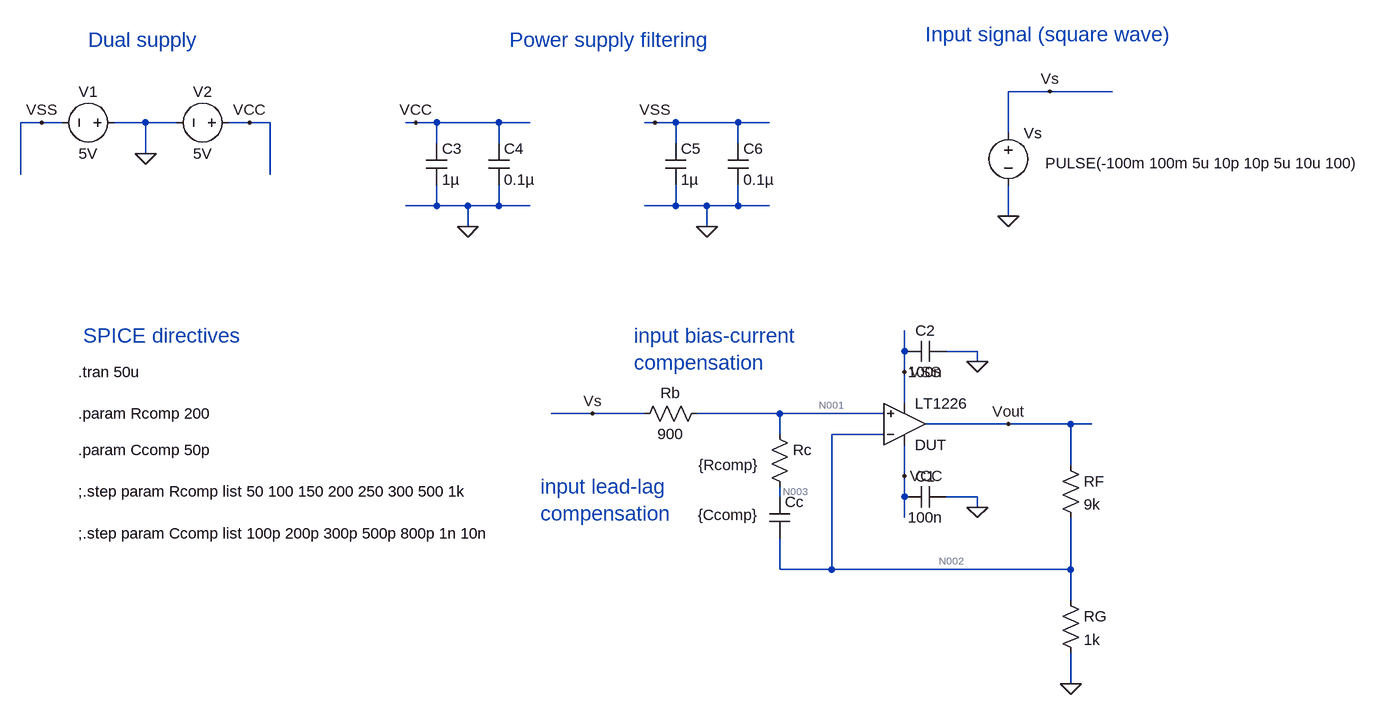
[diagram p0: schematic tb_lag_compensation.asc]
tb_lag_compensation.asc, the LTspice schematic file:
Version 4
SHEET 1 2184 868
WIRE 704 -336 640 -336
WIRE 800 -336 704 -336
WIRE -848 -288 -880 -288
WIRE -816 -288 -848 -288
WIRE -688 -288 -736 -288
WIRE -640 -288 -688 -288
WIRE -528 -288 -560 -288
WIRE -496 -288 -528 -288
WIRE -272 -288 -288 -288
WIRE -240 -288 -272 -288
WIRE -144 -288 -240 -288
WIRE -96 -288 -144 -288
WIRE 96 -288 80 -288
WIRE 128 -288 96 -288
WIRE 224 -288 128 -288
WIRE 272 -288 224 -288
WIRE 640 -272 640 -336
WIRE -240 -256 -240 -288
WIRE -144 -256 -144 -288
WIRE 128 -256 128 -288
WIRE 224 -256 224 -288
WIRE -688 -240 -688 -288
WIRE -880 -208 -880 -288
WIRE -496 -208 -496 -288
WIRE -240 -160 -240 -192
WIRE -240 -160 -288 -160
WIRE -192 -160 -240 -160
WIRE -144 -160 -144 -192
WIRE -144 -160 -192 -160
WIRE -96 -160 -144 -160
WIRE 128 -160 128 -192
WIRE 128 -160 80 -160
WIRE 176 -160 128 -160
WIRE 224 -160 224 -192
WIRE 224 -160 176 -160
WIRE 272 -160 224 -160
WIRE 640 -144 640 -192
WIRE -192 -128 -192 -160
WIRE 176 -128 176 -160
WIRE 480 64 480 32
WIRE 592 64 544 64
WIRE 592 80 592 64
WIRE 480 96 480 64
WIRE 480 144 480 96
WIRE 0 160 -64 160
WIRE 80 160 0 160
WIRE 288 160 160 160
WIRE 448 160 288 160
WIRE 640 176 512 176
WIRE 736 176 640 176
WIRE 768 176 736 176
WIRE 288 192 288 160
WIRE 448 192 368 192
WIRE 736 240 736 176
WIRE 480 256 480 208
WIRE 288 288 288 272
WIRE 480 288 480 256
WIRE 592 288 544 288
WIRE 592 304 592 288
WIRE 480 320 480 288
WIRE 288 400 288 352
WIRE 368 400 368 192
WIRE 368 400 288 400
WIRE 736 400 736 320
WIRE 736 400 368 400
WIRE 736 448 736 400
WIRE 736 576 736 528
FLAG -688 -240 0
FLAG -528 -288 VCC
FLAG -848 -288 VSS
FLAG -192 -128 0
FLAG 176 -128 0
FLAG -272 -288 VCC
FLAG 96 -288 VSS
FLAG 480 256 VCC
FLAG 480 96 VSS
FLAG 640 176 Vout
FLAG 640 -144 0
FLAG 704 -336 Vs
FLAG 592 80 0
FLAG 592 304 0
FLAG 736 576 0
FLAG 0 160 Vs
SYMBOL voltage -720 -288 R90
WINDOW 0 -32 56 VBottom 2
WINDOW 3 32 56 VTop 2
WINDOW 123 0 0 Left 2
WINDOW 39 0 0 Left 2
SYMATTR InstName V1
SYMATTR Value 5V
SYMBOL voltage -544 -288 R90
WINDOW 0 -32 56 VBottom 2
WINDOW 3 32 56 VTop 2
SYMATTR InstName V2
SYMATTR Value 5V
SYMBOL cap -256 -256 R0
SYMATTR InstName C3
SYMATTR Value 1µ
SYMBOL cap -160 -256 R0
SYMATTR InstName C4
SYMATTR Value 0.1µ
SYMBOL cap 112 -256 R0
SYMATTR InstName C5
SYMATTR Value 1µ
SYMBOL cap 208 -256 R0
SYMATTR InstName C6
SYMATTR Value 0.1µ
SYMBOL Opamps\\LT1226 480 240 M180
SYMATTR InstName DUT
SYMBOL cap 544 304 M270
WINDOW 0 32 32 VTop 2
WINDOW 3 0 32 VBottom 2
SYMATTR InstName C1
SYMATTR Value 100n
SYMBOL cap 544 80 M270
WINDOW 0 32 32 VTop 2
WINDOW 3 0 32 VBottom 2
SYMATTR InstName C2
SYMATTR Value 100n
SYMBOL voltage 640 -288 R0
WINDOW 3 57 62 Left 2
WINDOW 123 0 0 Left 2
WINDOW 39 0 0 Left 2
SYMATTR Value PULSE(-100m 100m 5u 10p 10p 5u 10u 100)
SYMATTR InstName Vs
SYMBOL res 720 224 R0
SYMATTR InstName RF
SYMATTR Value 9k
SYMBOL res 720 432 R0
SYMATTR InstName RG
SYMATTR Value 1k
SYMBOL res 272 176 R0
WINDOW 3 -109 63 Left 2
SYMATTR InstName Rc
SYMATTR Value {Rcomp}
SYMBOL cap 272 288 R0
WINDOW 3 -110 28 Left 2
SYMATTR InstName Cc
SYMATTR Value {Ccomp}
SYMBOL res 176 144 R90
WINDOW 0 0 56 VBottom 2
WINDOW 3 32 56 VTop 2
SYMATTR InstName Rb
SYMATTR Value 900
TEXT -776 -416 Left 3 ;Dual supply
TEXT -128 -416 Left 3 ;Power supply filtering
TEXT -792 96 Left 2 !.tran 50u
TEXT -784 40 Left 3 ;SPICE directives
TEXT 512 -424 Left 3 ;Input signal (square wave)
TEXT -792 160 Left 2 !.param Rcomp 200
TEXT -792 216 Left 2 !.param Ccomp 50p
TEXT -792 280 Left 2 !;.step param Rcomp list 50 100 150 200 250 300 500 1k
TEXT -792 344 Left 2 !;.step param Ccomp list 100p 200p 300p 500p 800p 1n 10n
TEXT -80 272 Left 3 ;input lead-lag\ncompensation
TEXT 64 40 Left 3 ;input bias-current\ncompensation

The netlist it stands for:
* tb_lag_compensation.asc
V1 0 VSS 5V
V2 VCC 0 5V
C3 VCC 0 1µ
C4 VCC 0 0.1µ
C5 VSS 0 1µ
C6 VSS 0 0.1µ
XDUT N001 N002 VCC VSS Vout LT1226  ; pins In+ In- V+ V- OUT
C1 0 VCC 100n
C2 0 VSS 100n
Vs Vs 0 PULSE(-100m 100m 5u 10p 10p 5u 10u 100)
RF Vout N002 9k
RG N002 0 1k
Rc N001 N003 {Rcomp}
Cc N003 N002 {Ccomp}
Rb N001 Vs 900
* Dual supply
* Power supply filtering
.tran 50u
* SPICE directives
* Input signal (square wave)
.param Rcomp 200
.param Ccomp 50p
;.step param Rcomp list 50 100 150 200 250 300 500 1k
;.step param Ccomp list 100p 200p 300p 500p 800p 1n 10n
* input lead-lag
* compensation
* input bias-current
* compensation
.backanno
.end

* Results of the author's LTspice run, read from the files saved beside the schematic
* Operating Point, zero values left out:
*   V(vss) = -5 V
*   V(vcc) = 5 V
*   V(n002) = -103.6 mV
*   V(n001) = -103.6 mV
*   V(vout) = -999.9 mV
*   V(vs) = -100 mV
*   V(n003) = -103.6 mV
*   I(Rb) = -3.998 µA
*   I(Rg) = -103.6 µA
*   I(Rf) = -99.59 µA
*   I(Vs) = -3.998 µA
*   I(V2) = -6.951 mA
*   I(V1) = -7.059 mA
*   Ix(dut:1) = 3.998 µA
*   Ix(dut:2) = 3.999 µA
*   Ix(dut:3) = 6.951 mA
*   Ix(dut:4) = -7.059 mA
*   Ix(dut:5) = 99.59 µA
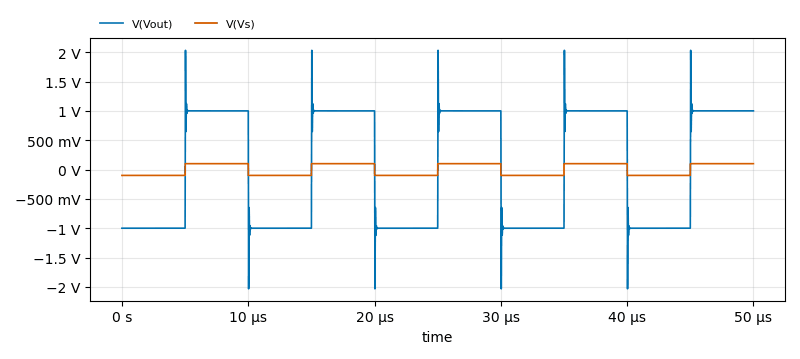
[diagram p1: Transient Analysis of tb_lag_compensation.asc, plotted from the saved traces]
* Transient Analysis, 1 run:
*   V(Vout): min -2.033 V, max 2.031 V, average -81.6 µV, rms 1.004 V, last 999.9 mV
*   V(Vs): min -100 mV, max 100 mV, average 140 nV, rms 100 mV, last 100 mV